# Altium schematic sheet SolidStateTeslaCoil_SCHEMATIC.SchDoc
size A4; SheetNumber: 1; SheetTotal: 3
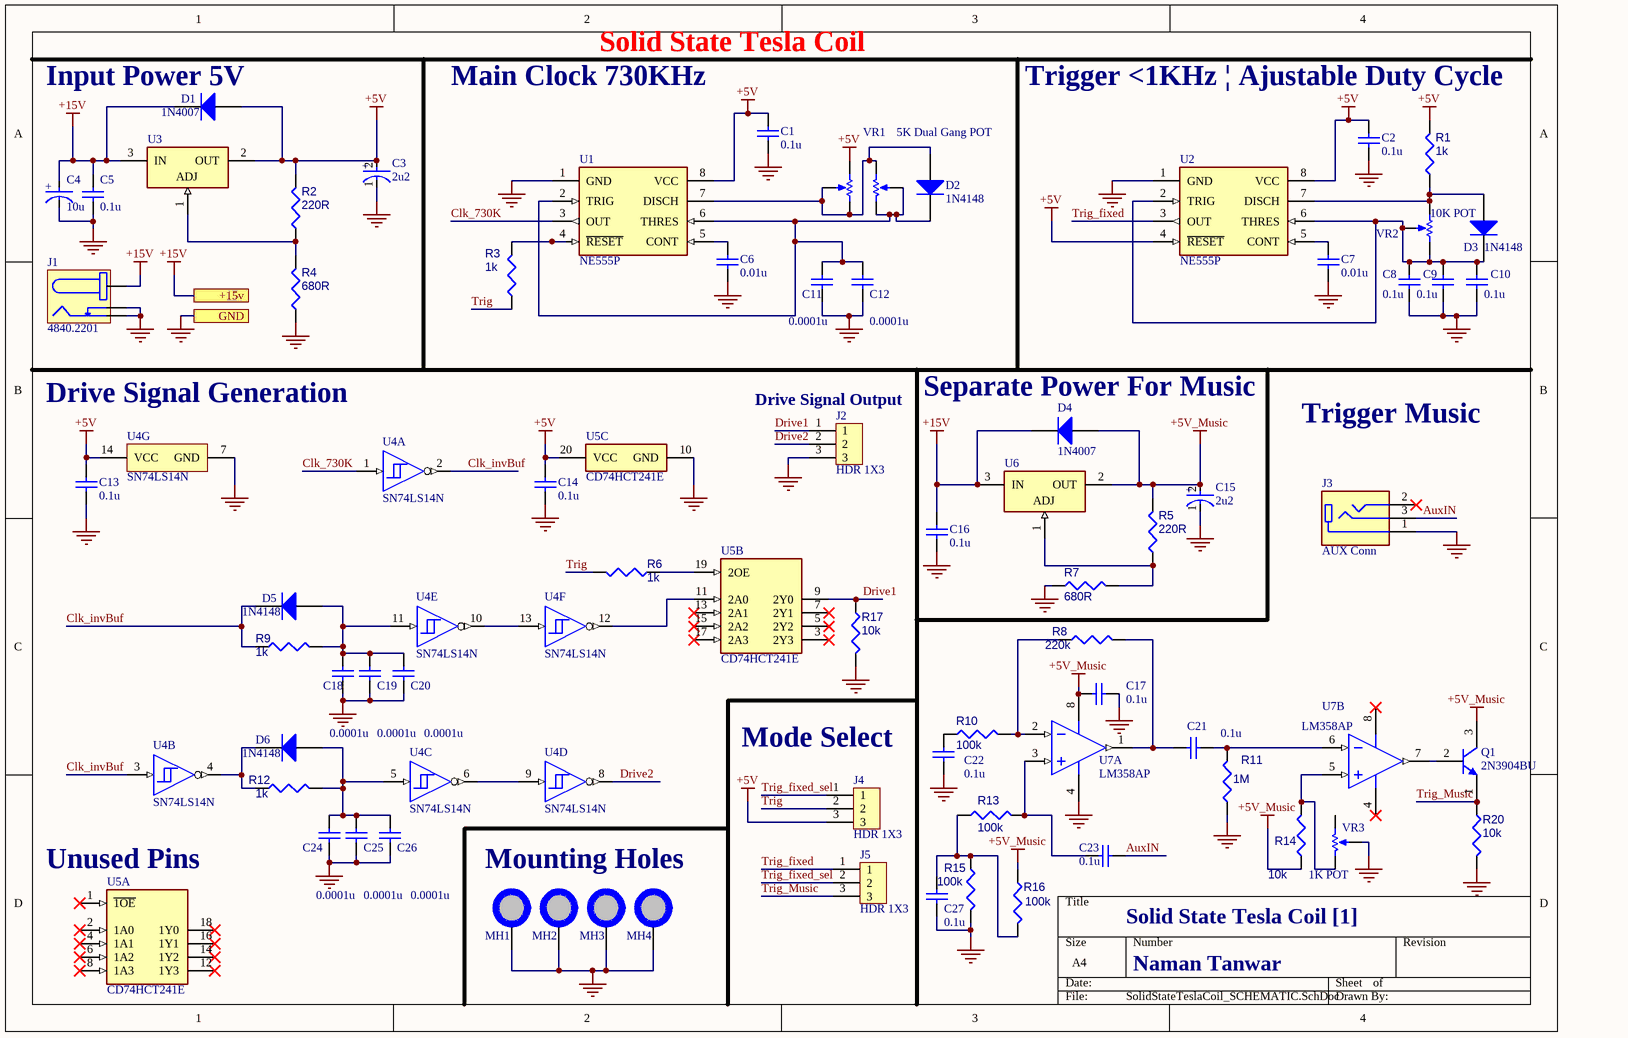
[diagram p0: SolidStateTeslaCoil_SCHEMATIC.SchDoc]

## Parts
C1  0.1u  [Ceramic Capacitor THT]
C2  0.1u  [Ceramic Capacitor THT]
C3  2u2  [FP-RAD-TH-D_5_0_5-L_11_1-MFG]
C4  10u  [FP-RAD-TH-D_5_0_5-L_11_1-MFG]
C5  0.1u  [Ceramic Capacitor THT]
C6  0.01u  [Ceramic Capacitor THT]
C7  0.01u  [Ceramic Capacitor THT]
C8  0.1u  [Ceramic Capacitor THT]
C9  0.1u  [Ceramic Capacitor THT]
C10  0.1u  [Ceramic Capacitor THT]
C11  0.0001u  [Ceramic Capacitor THT]
C12  0.0001u  [Ceramic Capacitor THT]
C13  0.1u  [Ceramic Capacitor THT]
C14  0.1u  [Ceramic Capacitor THT]
C15  2u2  [FP-RAD-TH-D_5_0_5-L_11_1-MFG]
C16  0.1u  [Ceramic Capacitor THT]
C17  0.1u  [Ceramic Capacitor THT]
C18  0.0001u  [Ceramic Capacitor THT]
C19  0.0001u  [Ceramic Capacitor THT]
C20  0.0001u  [Ceramic Capacitor THT]
C21  0.1u  [Ceramic Capacitor THT]
C22  0.1u  [Ceramic Capacitor THT]
C23  0.1u  [Ceramic Capacitor THT]
C24  0.0001u  [Ceramic Capacitor THT]
C25  0.0001u  [Ceramic Capacitor THT]
C26  0.0001u  [Ceramic Capacitor THT]
C27  0.1u  [Ceramic Capacitor THT]
D1  1N4007  [Diode]
D2  1N4148  [Diode]
D3  1N4148  [Diode]
D4  1N4007  [Diode]
D5  1N4148  [Diode]
D6  1N4148  [Diode]
J1  4840.2201  [DC_JACK]
J2  HDR 1X3  [HDR_1x3_2.54mm]
J3  AUX Conn  [CUI_SJ1-3523NG]
J4  HDR 1X3  [HDR_1x3_2.54mm]
J5  HDR 1X3  [HDR_1x3_2.54mm]
MH1  MH_7.4MMC_3.2MMD  [MH_7.4MMC_3.2MMD]  (value not drawn)  (no BOM)
MH2  MH_7.4MMC_3.2MMD  [MH_7.4MMC_3.2MMD]  (value not drawn)  (no BOM)
MH3  MH_7.4MMC_3.2MMD  [MH_7.4MMC_3.2MMD]  (value not drawn)  (no BOM)
MH4  MH_7.4MMC_3.2MMD  [MH_7.4MMC_3.2MMD]  (value not drawn)  (no BOM)
Q1  2N3904BU  [FAIR-TO-92]
R1  1k  [RESA60-630X240]
R2  220R  [RESA60-630X240]
R3  1k  [RESA60-630X240]
R4  680R  [RESA60-630X240]
R5  220R  [RESA60-630X240]
R6  1k  [RESA60-630X240]
R7  680R  [RESA60-630X240]
R8  220k  [RESA60-630X240]
R9  1k  [RESA60-630X240]
R10  100k  [RESA60-630X240]
R11  1M  [RESA60-630X240]
R12  1k  [RESA60-630X240]
R13  100k  [RESA60-630X240]
R14  10k  [RESA60-630X240]
R15  100k  [RESA60-630X240]
R16  100k  [RESA60-630X240]
R17  10k  [RESA60-630X240]
R20  10k  [RESA60-630X240]
U1  NE555P  [8PinDIP]
U2  NE555P  [8PinDIP]
U3  LM317T  [TO-220]  (value not drawn)
U4  SN74LS14N  [14PINDIP]  (parts A,B,C,D,E,F,G of 7)
U5  CD74HCT241E  [20PINDIP]  (parts A,B,C of 3)
U6  LM317T  [TO-220]  (value not drawn)
U7  LM358AP  [8PinDIP]  (parts A,B of 2)
VR1  5K Dual Gang POT  [Dual Gang Pot]
VR2  10K POT  [BOUR-3852A-282-103AL-3_V]
VR3  1K POT  [BOUR-3852A-282-103AL-3_V]

## Ports
+15v (see SolidStateTeslaCoil_GateCoilDriver_SCHEMATIC[1A]), GND (see SolidStateTeslaCoil_GateCoilDriver_SCHEMATIC[1B])

## Nets
+5V: C1.2 C2.2 C3.2(A) C13.1 C14.1 D1.1(A) J4.3 R1.2 R2.2 U1.8(VCC) U2.4(~{RESET}) U2.8(VCC) U3.2(OUT) U4.14(VCC) U5.20(VCC) VR1.1(CCW)
+5V_Music: C15.2(A) C17.1 D4.1(A) Q1.3(C) R5.2 R14.1 R16.1 U6.2(OUT) U7.8(VCC)
+15V: C4.2(A) C5.2 C16.2 D1.2(K) D4.2(K) J1.1 U3.3(IN) U6.3(IN) ; port +15v
GND: C1.1 C2.1 C3.1(C) C4.1(C) C5.1 C6.1 C7.1 C8.1 C9.1 C10.1 C11.1 C12.1 C13.2 C14.2 C15.1(C) C16.1 C17.2 C18.1 C19.1 C20.1 C22.1 C24.1 C25.1 C26.1 C27.1 J1.2 J1.3 J2.3 J3.1 MH1.1 MH2.1 MH3.1 MH4.1 R4.1 R7.1 R11.1 R15.2 R17.2 R20.2 U1.1(GND) U2.1(GND) U4.7(GND) U5.10(GND) U7.4(GND) VR3.2(S) ; port GND
AuxIN: C23.1 J3.3
Clk_730K: U1.3(OUT) U4.1(1A)
Clk_invBuf: D5.2(K) R9.1 U4.2(~{1Y}) U4.3(2A)
Drive1: J2.1 R17.1 U5.9(2Y0)
Drive2: J2.2 U4.8(~{4Y})
Trig: J4.2 R3.1 R6.2
Trig_fixed: J5.1 U2.3(OUT)
Trig_fixed_sel: J4.1 J5.2
Trig_Music: J5.3 Q1.1(E) R20.1
NetC6_2: C6.2 U1.5(CONT)
NetC7_2: C7.2 U2.5(CONT)
NetC8_2: C8.2 C9.2 C10.2 D3.2(K) U2.2(TRIG) U2.6(THRES) VR2.2(S) VR2.3(CW)
NetC11_2: C11.2 C12.2 D2.2(K) U1.2(TRIG) U1.6(THRES) VR1.5(S) VR1.6(CW)
NetC18_2: C18.2 C19.2 C20.2 D5.1(A) R9.2 U4.11(5A)
NetC21_1: C21.1 R8.2 U7.1(1OUT)
NetC21_2: C21.2 R11.2 U7.6(2IN-)
NetC22_2: C22.2 R10.1
NetC23_2: C23.2 R13.2 U7.3(1IN+)
NetC24_2: C24.2 C25.2 C26.2 D6.1(A) R12.2 U4.5(3A)
NetC27_2: C27.2 R13.1 R15.1 R16.2
NetD2_1: D2.1(A) U1.7(DISCH) VR1.2(S) VR1.3(CW) VR1.4(CCW)
NetD3_1: D3.1(A) R1.1 U2.7(DISCH) VR2.1(CCW)
NetD6_2: D6.2(K) R12.1 U4.4(~{2Y})
NetQ1_2: Q1.2(B) U7.7(2OUT)
NetR2_1: R2.1 R4.2 U3.1(ADJ)
NetR3_2: R3.2 U1.4(~{RESET})
NetR5_1: R5.1 R7.2 U6.1(ADJ)
NetR6_1: R6.1 U5.19(2OE)
NetR8_1: R8.1 R10.2 U7.2(1IN-)
NetR14_2: R14.2 U7.5(2IN+) VR3.3(CW)
NetU4_6: U4.6(~{3Y}) U4.9(4A)
NetU4_10: U4.10(~{5Y}) U4.13(6A)
NetU4_12: U4.12(~{6Y}) U5.11(2A0)

Not connected (* = marked no-connect by the designer): J3 2*; U5 1(~{1OE})* 2(1A0)* 3(2Y3)* 4(1A1)* 5(2Y2)* 6(1A2)* 7(2Y1)* 8(1A3)* 12(1Y3)* 13(2A1)* 14(1Y2)* 15(2A2)* 16(1Y1)* 17(2A3)* 18(1Y0)*; VR3 1(CCW)

## Notes on the sheet
- (near D1) Input Power 5V
- Main Clock 730KHz
- Solid State Tesla Coil
- Trigger <1KHz | Ajustable Duty Cycle
- (near U4) Drive Signal Generation
- (near J2) Drive Signal Output
- (near D4) Separate Power For Music
- Trigger Music
- Mode Select
- (near U5) Unused Pins
- Mounting Holes
- Solid State Tesla Coil [1]
- Naman Tanwar
- (in symbol 2u2 Electrolytic Capacitor) +
- (in symbol 10u Electrolytic Capacitor_1) +

## Library data of the parts
C1 C2 C5 C8-C10 C13 C14 C16 C17 C21-C23 C27 = 0.1u 104 Ceramic Capacitor: Ceramic Capacitor, 100 nF, +/- 10%, 50 V, -55 to 125 degC, 2-Pin THD, RoHS, Tape and Reel; Manufacturer: Vishay; Other Names: BC1084CT; Catalog Drawings: Mono-KapSide2-15_5.58Mono-KapSide1_15; Temperature Coefficient: X7R; Voltage - Rated: 50V; Online Catalog: Mono-Kap™Series; Capacitance: 0.1µF; Size / Dimension: 0.157"Lx0.098"W(4.00mmx2.50mm); Operating Temperature: -55°C~125°C; Family: CeramicCapacitors; Manufacturer URL: http://www.vishay.com/; Standard Package: 1; Thickness (Max): -; Ratings: -; Datasheet Version: 08/2013; Package Description: 2-Pin Through Hole Device, Body 4 x 2.6 mm; Mounting Type: ThroughHole; Features: -; Lead Spacing: 0.098"(2.50mm); Tolerance: ±10%; Category: Capacitors; Mounting Technology: ThroughHole; Lead Style: Straight; Datasheet URL: http://www.vishay.com/docs/45171/kseries.pdf; Applications: GeneralPurpose; Package / Case: Radial; Height - Seated (Max): 0.220"(5.58mm); Package Reference: K104K15X7RF5TL2; Series: Mono-Kap™K; Packaging: CutTape(CT)
C3 C15 = 2u2 Electrolytic Capacitor: Aluminum Electrolytic Capacitors (Radial Lead Type) AEC-Q200 Qualified 2.2uF ±20% 50V; Polarity: Polar; Ripple Current: 45mA; Impedance: 1.8R; Lead Diameter: 0.5mm; Life (Hours): 1000Hour; Voltage Rating: 50V; Case/Package: Radial; Packaging: Tape and Reel; Diameter: 5mm; Construction: RADIAL; Mount: Through Hole; Radiation Hardening: No; Tolerance: 20%; Min Operating Temperature: -55°C; Length: 11mm; Voltage Rating (DC): 50V; Height: 11mm; Max Operating Temperature: 105°C; Package Quantity: 2000; Height - Seated (Max): 0.472inch; ESR (Equivalent Series Resistance): 1.8R; Features: General Purpose; Capacitance: 2.2uF; Lead Pitch: 5mm; Series: FC; RoHS Compliant: Yes; Termination: Radial
C4 = 10u Electrolytic Capacitor_1: Aluminum Electrolytic Capacitors 10u; Voltage Rating: 50V; Tolerance: 20%; Polarity: Polar; Ripple Current: 45mA; Impedance: 1.8R; Lead Diameter: 0.5mm; Capacitance: 2.2uF; Life (Hours): 1000Hour; Case/Package: Radial; Packaging: Tape and Reel; Diameter: 5mm; Construction: RADIAL; Mount: Through Hole; Radiation Hardening: No; Min Operating Temperature: -55°C; Length: 11mm; Voltage Rating (DC): 50V; Height: 11mm; Max Operating Temperature: 105°C; Package Quantity: 2000; Height - Seated (Max): 0.472inch; ESR (Equivalent Series Resistance): 1.8R; Features: General Purpose; Lead Pitch: 5mm; Series: FC; RoHS Compliant: Yes; Termination: Radial
C6 C7 = 0.01u 103 Ceramic Capacitor: Ceramic Capacitor, 10 nF, +/- 10%, 50 V, -55 to 125 degC, 2-Pin THD, RoHS, Tape and Reel; Manufacturer: Vishay; Other Names: BC1084CT; Catalog Drawings: Mono-KapSide2-15_5.58Mono-KapSide1_15; Temperature Coefficient: X7R; Voltage - Rated: 50V; Online Catalog: Mono-Kap™Series; Capacitance: 0.1µF; Size / Dimension: 0.157"Lx0.098"W(4.00mmx2.50mm); Operating Temperature: -55°C~125°C; Family: CeramicCapacitors; Manufacturer URL: http://www.vishay.com/; Standard Package: 1; Thickness (Max): -; Ratings: -; Datasheet Version: 08/2013; Package Description: 2-Pin Through Hole Device, Body 4 x 2.6 mm; Mounting Type: ThroughHole; Features: -; Lead Spacing: 0.098"(2.50mm); Tolerance: ±10%; Category: Capacitors; Mounting Technology: ThroughHole; Lead Style: Straight; Datasheet URL: http://www.vishay.com/docs/45171/kseries.pdf; Applications: GeneralPurpose; Package / Case: Radial; Height - Seated (Max): 0.220"(5.58mm); Package Reference: K104K15X7RF5TL2; Series: Mono-Kap™K; Packaging: CutTape(CT)
C11 C12 C18-C20 C24-C26 = 0.0001u 101 Ceramic Capacitor: Ceramic Capacitor, 0.1 nF, +/- 10%, 50 V, -55 to 125 degC, 2-Pin THD, RoHS, Tape and Reel; Manufacturer: Vishay; Other Names: BC1084CT; Catalog Drawings: Mono-KapSide2-15_5.58Mono-KapSide1_15; Temperature Coefficient: X7R; Voltage - Rated: 50V; Online Catalog: Mono-Kap™Series; Capacitance: 0.1µF; Size / Dimension: 0.157"Lx0.098"W(4.00mmx2.50mm); Operating Temperature: -55°C~125°C; Family: CeramicCapacitors; Manufacturer URL: http://www.vishay.com/; Standard Package: 1; Thickness (Max): -; Ratings: -; Datasheet Version: 08/2013; Package Description: 2-Pin Through Hole Device, Body 4 x 2.6 mm; Mounting Type: ThroughHole; Features: -; Lead Spacing: 0.098"(2.50mm); Tolerance: ±10%; Category: Capacitors; Mounting Technology: ThroughHole; Lead Style: Straight; Datasheet URL: http://www.vishay.com/docs/45171/kseries.pdf; Applications: GeneralPurpose; Package / Case: Radial; Height - Seated (Max): 0.220"(5.58mm); Package Reference: K104K15X7RF5TL2; Series: Mono-Kap™K; Packaging: CutTape(CT)
D1 D4 = 1N4007: 1N4007 Generic Diode; Manufacturer: Fairchild; Elements: 1; Recovery Time: 4ns; Forward Current: 300mA; Power: 500mW; Forward Voltage: 1V; Max Surge Current: 4A; Peak Reverse Current: 5uA; Datasheet URL: http://www.nxp.com/documents/data_sheet/1N4148_1N4448.pdf; Min Operating Temperature: -65°C; Manufacturer URL: https://www.fairchildsemi.com/; Packaging: Bulk; Diameter: 1.91mm; Pins: 2; Package URL: http://www.nxp.com/documents/data_sheet/1N4148_1N4448.pdf; Package Reference: SOD27; Max Operating Temperature: 175°C; Package Quantity: 2000; Case/Package: DO; Datasheet Version: Aug-04; RoHS Compliant: True
D2 D3 D5 D6 = 1N4148: High Speed Diode, 100 V, 0.45 A, -65 to 175 degC, 2-Pin SOD27, RoHS, Bulk; Manufacturer: Fairchild; Elements: 1; Recovery Time: 4ns; Forward Current: 300mA; Power: 500mW; Forward Voltage: 1V; Max Surge Current: 4A; Peak Reverse Current: 5uA; Datasheet URL: http://www.nxp.com/documents/data_sheet/1N4148_1N4448.pdf; Min Operating Temperature: -65°C; Manufacturer URL: https://www.fairchildsemi.com/; Packaging: Bulk; Diameter: 1.91mm; Pins: 2; Package URL: http://www.nxp.com/documents/data_sheet/1N4148_1N4448.pdf; Package Reference: SOD27; Max Operating Temperature: 175°C; Package Quantity: 2000; Case/Package: DO; Datasheet Version: Aug-04; RoHS Compliant: True
J1 = DC JACK: DC Connector Socket 6x2mm 2-Pole 12VDC 0.5A 500VDC Dielectric Solder Term PCB Mt; Manufacturer: Schurter; Number of Terminals/Pins: 3; Gender: Male; Shielding: Unshielded; Current Rating: 500mA; Voltage Rating: 12V; Number of Ports: 1; Connector Type: Jack; Pin Diameter: 2mm; Supplier 1: Digi-Key; Manufacturer Part Number: 4840.2201; RoHS: Yes; Category: Connectors; Stock 1: 9153; Pricing 1: 1=1.82000, 50=1.67900, 100=1.41120 (USD); Mounting Technology: Through Hole; Color: Black; Contact Material: Copper Alloy; Housing Material: PC; Weight: 0.007125oz; Contact Plating: Tin; Housing Color: Black; Termination: Solder; Number of Contacts: 3; Orientation: Right Angle; Package Quantity: 500; Series: 4840; Length: 9mm; Width: 9mm; Depth: 14.5mm; Radiation Hardening: No; Lead Free: Lead Free; RoHS Compliant: Yes; ComponentLink1URL: https://datasheet.ciiva.com/26837/getdatasheetpartid-572408-26837414.pdf?src-supplier=Verical; ComponentLink1Description: https://datasheet.ciiva.com/26837/getdatasheetpartid-572408-26837414.pdf?src-supplier=Verical; ComponentLink2URL: https://datasheet.ciiva.com/16318/typ-4840-1200-16318967.pdf?src-supplier=Future+Electronics; ComponentLink2Description: https://datasheet.ciiva.com/16318/typ-4840-1200-16318967.pdf?src-supplier=Future+Electronics; ComponentLink3URL: https://datasheet.ciiva.com/12342/typ-4840-2201-65401-12342879.pdf?src-supplier=Mouser; ComponentLink3Description: https://datasheet.ciiva.com/12342/typ-4840-2201-65401-12342879.pdf?src-supplier=Mouser; ComponentLink4URL: https://datasheet.ciiva.com/391/typ-4840-2201-391834.pdf?src-supplier=Digi-Key; ComponentLink4Description: https://datasheet.ciiva.com/391/typ-4840-2201-391834.pdf?src-supplier=Digi-Key; Supplier Part Number 1: 486-3381-ND
J2 J4 J5 = 68000-103HLF: Conn Unshrouded Header HDR 3 POS 2.54mm Solder ST Top Entry Thru-Hole BergStik® Automotive Bulk; Manufacturer: Amphenol ICC / FCI; Supplier 1: Digi-Key; Manufacturer Part Number: 68000-103HLF; RoHS: No; Category: Headers and Wire Housings; ComponentLink1URL: https://datasheet.ciiva.com/46392/1914865-46392021.pdf?src-supplier=Element14; ComponentLink1Description: https://datasheet.ciiva.com/46392/1914865-46392021.pdf?src-supplier=Element14; Supplier Part Number 1: 609-3461-ND
J3 = SJ1-3523NG: 3.5 mm Right-Angle Stereo Jack, 3 Pin PCB Mount, Isolated Ground; Availability: Unavailable; MP: SJ1-3523NG; Price: None; Case/Package: None; Pins: 3; Component Type: Standard; Design Item ID: SJ1-3523NG; Value: *; Source: SJ1-3523NG.SchLib
MH1-MH4 = MH_7.4MMC_3.2MMD: Mounting Hole 7.4mm Diameter, 3.2mm Drill
Q1 = 2N3904: NPN General-Purpose Amplifier, 40 V VCEO, 0.2 A, -55 to 150 degC, 2-Pin TO-92, RoHS, Bulk; Manufacturer: FairchildSemiconductor; Maximum Collector Base Voltage: 60V; Minimum DC Current Gain: 40@0.1mA@1V|70@1mA@1V|100@10mA@1V|60@50mA@1V|30@100mA@1V; Maximum Collector Emitter Voltage: 40V; Maximum DC Collector Current: 0.2A; Rad Hard: No; Maximum Operating Frequency: 300(Min)MHz; Maximum Collector Emitter Saturation Voltage: 0.2@1mA@10mA|0.3@5mA@50mAV; Maximum Power Dissipation: 625mW; Package Description: 3-Pin Transistor Outline Package, Body Dia 4.79 mm, Pitch 1.27 mm; Package Reference: TO-92; Pin Count: 3; Operating Temperature: -55to150degC; Category: GPBJT; Manufacturer URL: https://www.fairchildsemi.com/; Datasheet URL: https://datasheet.ciiva.com/4722/2n3904-82270-4722369.pdf; Package: 3TO-92; Packaging: Bulk; Type: NPN; Datasheet Version: Rev. 1.1.0, 10/2014; Mounting: ThroughHole
R1 R3 R6 R9 R12 = 1k MFR-25FBF52-1K: Axial Resistor, 1 KOhm, +/- 1%, 250 mW, -55 to 155 degC, 2-Pin THD, RoHS, Bulk
R2 R5 = 220R: Axial Resistor, 220 Ohm,
R4 R7 = 680R: Axial Resistor, 680 Ohm,
R8 = 220k Axial Resistor: Axial Resistor, 220 KOhm,
R10 R13 R15 R16 = 100k Axial Resistor: Axial Resistor, 100 KOhm
R11 = 1M Axial Resistor: Axial Resistor, 1 MOhm,
R14 R17 R20 = 10k: Axial Resistor, 10 KOhm, +/- 1%, 250 mW, -55 to 155 degC, 2-Pin THD, RoHS, Bulk
U1 U2 = NE555: Precision Timer, 4.5 to 16 V, 0 to 70 degC, 8-Pin DIP, Pb-Free, Tube; Manufacturer: TexasInstruments; Maximum High Level Output Current: -200mA; Number of Internal Timers: 1; Operating Supply Voltage: 5|9|12|15V; Maximum Low Level Output Current: 200mA; Rad Hard: No; Packaging: Rail/Tube; Manufacturer URL: http://www.ti.com/; Package Reference: P8; Package Description: 8-Pin Double In-line Package, Body 9.59 x 6.35 mm, Pitch 2.54 mm; Package URL: http://www.ti.com/lit/ml/mpdi001b/mpdi001b.pdf; Type: Standard; Datasheet URL: http://www.ti.com/general/docs/lit/getliterature.tsp?genericPartNumber=NE555&fileType=pdf; Category: Timer; Package: 8PDIP; Datasheet Version: Rev. I, 09/2014
U3 U6 = LM317: Integrated Circuit 3-terminal Positive Adjustable Voltage Regulator TO-220 Case 1.2 To 37 Volts; Case/Package: TO-220; Pins: 3; RoHS Compliant: Yes
U4 = 74LS14: Hex schmitt-trigger inverters, N0014A, TUBE; Manufacturer: Texas Instruments; F @ Nom Voltage(Max)(Mhz): 35; Input Type: TTL; Technology Family: LS; Bits(#): 6; Output Drive (IOL/IOH)(Max)(mA): -0.4/8; ICC @ Nom Voltage(Max)(mA): 0.06; VCC(Min)(V): 4.75; Voltage(Nom)(V): 5; tpd @ Nom Voltage(Max)(ns): 22; Schmitt Trigger: Yes; VCC(Max)(V): 5.25; Rating: Catalog; Output Type: CMOS; PackageReference: N0014A; DatasheetVersion: SDLS049B; Code_JEDEC: MS-001; Generic Part Number: SN74LS14; Operating Temperature Range(C): 0 to 70
U5 = 74HCT241: High Speed CMOS Logic Non-Inverting Octal Buffer/Line Drivers with 3-State Outputs, N0020A, TUBE; Manufacturer: Texas Instruments; VCC(Min)(V): 4.5; Rating: Catalog; Bits(#): 8; tpd @ Nom Voltage(Max)(ns): 28; ICC @ Nom Voltage(Max)(mA): 0.08; Voltage(Nom)(V): 5; Input Type: TTL; F @ Nom Voltage(Max)(Mhz): 25; VCC(Max)(V): 5.5; Generic Part Number: CD74HCT241; PackageVersion: http://www.ti.com/lit/ml/mpdi002c/mpdi002c.pdf; PackageReference: N0020A; Operating Temperature Range(C): -55 to 125; DatasheetVersion: SCHS167E; Output Type: CMOS; Code_JEDEC: MS-001
U7 = LM358: Dual Operational Amplifier, 3 to 32 V, 0 to 70 degC, 8-Pin PDIP (P), Pb-Free (RoHS), Tube; Manufacturer: Texas Instruments (TI); Channels: 2; Max Dual Supply Voltage: 16V; Min Dual Supply Voltage: 1.5V; Slew Rate: 0.3V/us; Unity Gain Bandwidth Product: 700KHz; Common Mode Rejection Ratio: 65dB; Nominal Supply Voltage: 5V; Package Version: 4040082/E, 04/2010; Output Current: 30mA; Nominal Supply Current: 1.2mA; Nominal Voltage Gain: 100dB; Case/Package: DIP; Max Operating Temperature: 70°C; RoHS Compliant: True; Manufacturer URL: http://www.ti.com/; Pins: 8; Package Description: 8-Pin Double In-line Package, Body 9.59 x 6.35 mm, Pitch 2.54 mm; Datasheet URL: http://www.ti.com/lit/ds/symlink/lm358a.pdf; Max Supply Voltage: 16V; Package Reference: P0008A; Mounting Technology: TH; Min Operating Temperature: 0°C; Package URL: http://www.ti.com/lit/ml/mpdi001b/mpdi001b.pdf; Min Supply Voltage: 1.5V; Package Quantity: 50; Packaging: Rail/Tube; Datasheet Version: SLOS068T, 04/2015; Nominal Gain Bandwith Product: 700KHz
VR2 = 10K POT 3852A-282-103AL: Diameter Panel Control, 10 KOhm, +/- 10%, 2 W, -1 to 125 degC, 3-Pin THD, RoHS, Bulk; Manufacturer: Bourns; Temperature Coefficient: ±150ppm/degC; Number of Gangs: 1; Other Names: 3852A282103AL; Actuator Length: 0.875"(22.23mm); Resistive Material: Cermet; PCN Design/Specification: PBTResinJun/2011; Rotation: 280deg; PCN Other: MultipleChanges01/Dec/2012; Catalog Drawings: 3852SeriesSide1 / 3852SeriesSide2; Online Catalog: 3852and3856Series; Associated Product: 36-8560-ND / -KNOBINSTRUMW/DIALRND.9"DIA / 36-8555-ND / -KNOBINSTRUMSKIRTEDRND.7"DIA / 36-8556-ND / -KNOBINSTRUMSKIRTEDRND.9"DIA / 36-8565-ND / -KNOBINSTRUMDBLBARRND.7"DIA / 36-8566-ND / -KNOBINSTRUMDBLBARRND.9"DIA / 36-8568-ND / -KNOBINSTRUMSGLBARRND.7"DIA / 36-8569-ND / -KNOBINSTRUMSGLBARRND.9"DIA / 36-8559-ND / -KNOBINSTRUMW/DIALRND.7"DIA / 226-1006-ND / -KNOBBLKGLOSS.75"DIA.250"SHAFT / 226-1007-ND / -KNOBBLKGLOSS.925"DIA.250"SHAFT / 226-1011-ND / -KNOBBLKGLOS; Actuator Diameter: 0.250"(6.35mm); Built in Switch: None; Power (Watts): 2W; Actuator Type: Slotted; Standard Package: 45; Tolerance: ±10%; Taper: Linear; Series: 3852; Packaging: Bulk; Category: Potentiometers,VariableResistors; Bushing Thread: 3/8-32; Datasheet URL: https://datasheet.ciiva.com/11831/0900766b80f93b4b-11831016.pdf; Datasheet Version: Sep-14; Number of Turns: 1; Family: RotaryPotentiometers,Rheostats; Termination Style: SolderLug; Resistance (Ohms): 10k; RoHS Information: 3852A-LMaterialDeclaration; Mounting Type: PanelMount; Manufacturer URL: http://www.bourns.com/
VR3 = 1K POT 3852A-282-102AL: Diameter Panel Control, 1 KOhm, +/- 10%, 2 W, -1 to 125 degC, 3-Pin THD, RoHS, Bulk; Manufacturer: Bourns; Temperature Coefficient: ±150ppm/degC; Number of Gangs: 1; Other Names: 3852A282103AL; Actuator Length: 0.875"(22.23mm); Resistive Material: Cermet; PCN Design/Specification: PBTResinJun/2011; Rotation: 280deg; PCN Other: MultipleChanges01/Dec/2012; Catalog Drawings: 3852SeriesSide1 / 3852SeriesSide2; Online Catalog: 3852and3856Series; Associated Product: 36-8560-ND / -KNOBINSTRUMW/DIALRND.9"DIA / 36-8555-ND / -KNOBINSTRUMSKIRTEDRND.7"DIA / 36-8556-ND / -KNOBINSTRUMSKIRTEDRND.9"DIA / 36-8565-ND / -KNOBINSTRUMDBLBARRND.7"DIA / 36-8566-ND / -KNOBINSTRUMDBLBARRND.9"DIA / 36-8568-ND / -KNOBINSTRUMSGLBARRND.7"DIA / 36-8569-ND / -KNOBINSTRUMSGLBARRND.9"DIA / 36-8559-ND / -KNOBINSTRUMW/DIALRND.7"DIA / 226-1006-ND / -KNOBBLKGLOSS.75"DIA.250"SHAFT / 226-1007-ND / -KNOBBLKGLOSS.925"DIA.250"SHAFT / 226-1011-ND / -KNOBBLKGLOS; Actuator Diameter: 0.250"(6.35mm); Built in Switch: None; Resistance (Ohms): 10k; Power (Watts): 2W; Actuator Type: Slotted; Standard Package: 45; Tolerance: ±10%; Taper: Linear; Series: 3852; Packaging: Bulk; Category: Potentiometers,VariableResistors; Bushing Thread: 3/8-32; Datasheet URL: https://datasheet.ciiva.com/11831/0900766b80f93b4b-11831016.pdf; Datasheet Version: Sep-14; Number of Turns: 1; Family: RotaryPotentiometers,Rheostats; Termination Style: SolderLug; RoHS Information: 3852A-LMaterialDeclaration; Mounting Type: PanelMount; Manufacturer URL: http://www.bourns.com/